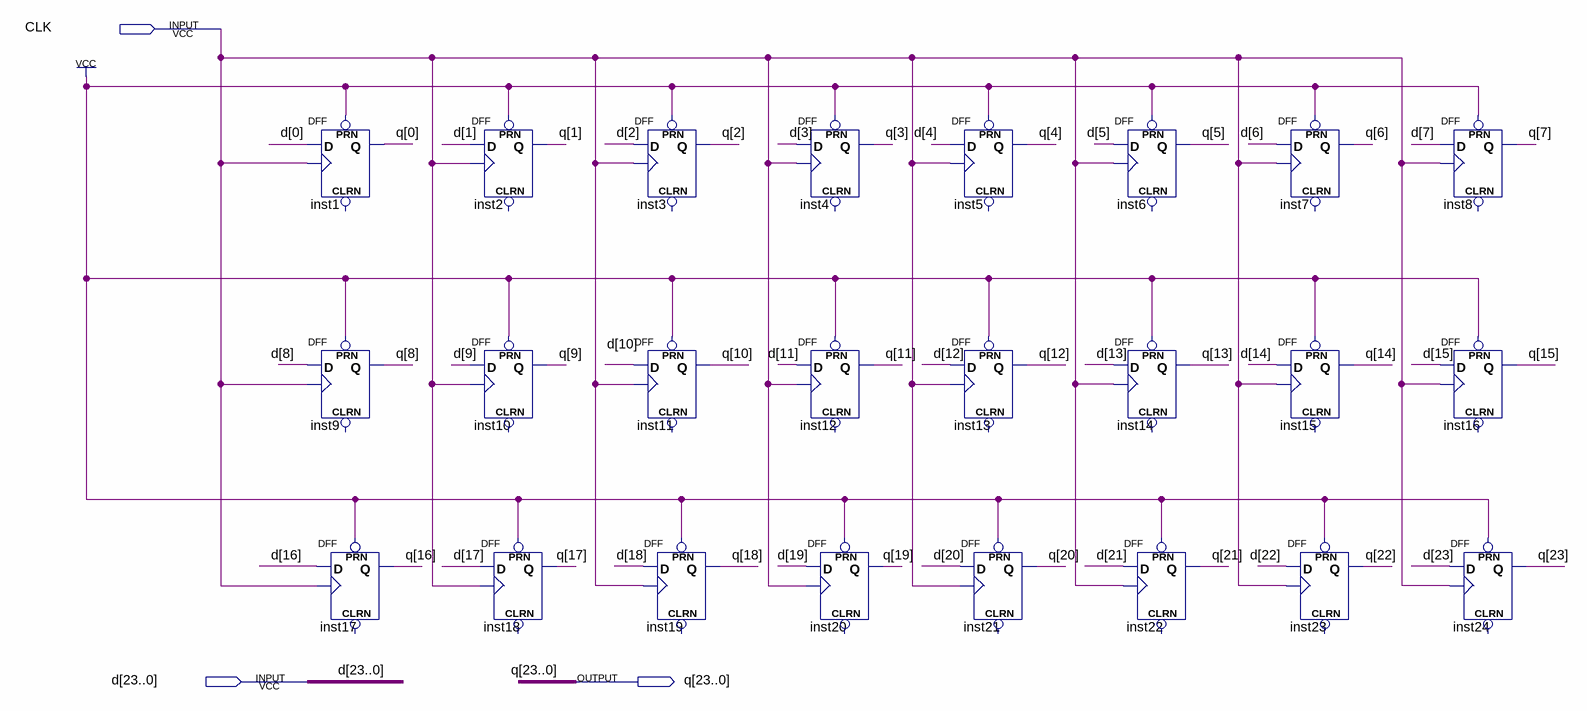
[diagram p0: schematic sheet]
// Quartus schematic uIR.bdf as structural Verilog: 24 symbols, 3 pins
module uIR (
  input  CLK,
  input  [23:0] d,
  output [23:0] q
);

  DFF inst1 (.CLK(CLK), .D(d[0]), .PRN(1'b1), .Q(q[0]));  // open: CLRN
  DFF inst9 (.CLK(CLK), .D(d[8]), .PRN(1'b1), .Q(q[8]));  // open: CLRN
  DFF inst17 (.CLK(CLK), .D(d[16]), .PRN(1'b1), .Q(q[16]));  // open: CLRN
  DFF inst2 (.CLK(CLK), .D(d[1]), .PRN(1'b1), .Q(q[1]));  // open: CLRN
  DFF inst10 (.CLK(CLK), .D(d[9]), .PRN(1'b1), .Q(q[9]));  // open: CLRN
  DFF inst18 (.CLK(CLK), .D(d[17]), .PRN(1'b1), .Q(q[17]));  // open: CLRN
  DFF inst3 (.CLK(CLK), .D(d[2]), .PRN(1'b1), .Q(q[2]));  // open: CLRN
  DFF inst11 (.CLK(CLK), .D(d[10]), .PRN(1'b1), .Q(q[10]));  // open: CLRN
  DFF inst19 (.CLK(CLK), .D(d[18]), .PRN(1'b1), .Q(q[18]));  // open: CLRN
  DFF inst4 (.CLK(CLK), .D(d[3]), .PRN(1'b1), .Q(q[3]));  // open: CLRN
  DFF inst12 (.CLK(CLK), .D(d[11]), .PRN(1'b1), .Q(q[11]));  // open: CLRN
  DFF inst20 (.CLK(CLK), .D(d[19]), .PRN(1'b1), .Q(q[19]));  // open: CLRN
  DFF inst5 (.CLK(CLK), .D(d[4]), .PRN(1'b1), .Q(q[4]));  // open: CLRN
  DFF inst13 (.CLK(CLK), .D(d[12]), .PRN(1'b1), .Q(q[12]));  // open: CLRN
  DFF inst21 (.CLK(CLK), .D(d[20]), .PRN(1'b1), .Q(q[20]));  // open: CLRN
  DFF inst6 (.CLK(CLK), .D(d[5]), .PRN(1'b1), .Q(q[5]));  // open: CLRN
  DFF inst14 (.CLK(CLK), .D(d[13]), .PRN(1'b1), .Q(q[13]));  // open: CLRN
  DFF inst22 (.CLK(CLK), .D(d[21]), .PRN(1'b1), .Q(q[21]));  // open: CLRN
  DFF inst7 (.CLK(CLK), .D(d[6]), .PRN(1'b1), .Q(q[6]));  // open: CLRN
  DFF inst15 (.CLK(CLK), .D(d[14]), .PRN(1'b1), .Q(q[14]));  // open: CLRN
  DFF inst23 (.CLK(CLK), .D(d[22]), .PRN(1'b1), .Q(q[22]));  // open: CLRN
  DFF inst8 (.CLK(CLK), .D(d[7]), .PRN(1'b1), .Q(q[7]));  // open: CLRN
  DFF inst16 (.CLK(CLK), .D(d[15]), .PRN(1'b1), .Q(q[15]));  // open: CLRN
  DFF inst24 (.CLK(CLK), .D(d[23]), .PRN(1'b1), .Q(q[23]));  // open: CLRN
endmodule
